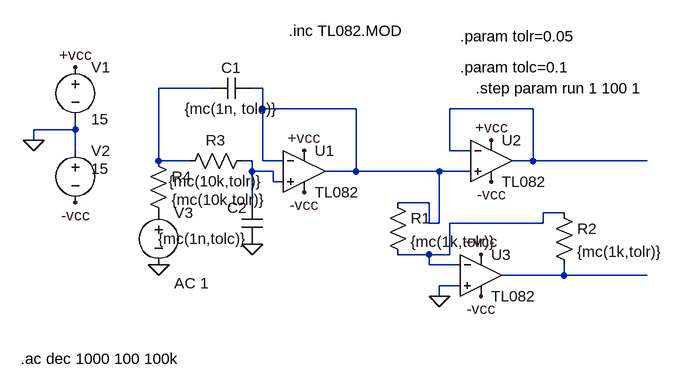
[diagram p0: schematic simSallenKey.asc]
simSallenKey.asc, the LTspice schematic file:
Version 4
SHEET 1 880 680
WIRE 0 0 -80 0
WIRE 80 0 64 0
WIRE 80 32 80 0
WIRE 224 32 80 32
WIRE 496 32 368 32
WIRE -208 64 -208 48
WIRE -208 64 -272 64
WIRE -272 80 -272 64
WIRE -208 96 -208 64
WIRE 368 96 368 32
WIRE 400 96 368 96
WIRE -80 112 -80 0
WIRE -32 112 -80 112
WIRE 64 112 48 112
WIRE 80 112 80 32
WIRE 112 112 80 112
WIRE 496 112 496 32
WIRE 496 112 464 112
WIRE 672 112 496 112
WIRE 64 128 64 112
WIRE 96 128 64 128
WIRE 224 128 224 32
WIRE 224 128 176 128
WIRE 352 128 224 128
WIRE 400 128 352 128
WIRE 96 144 96 128
WIRE 112 144 96 144
WIRE 64 176 64 128
WIRE 336 176 288 176
WIRE 544 192 512 192
WIRE 336 208 336 176
WIRE 352 208 352 128
WIRE 352 208 336 208
WIRE 512 208 512 192
WIRE 512 208 368 208
WIRE 336 256 288 256
WIRE 368 256 368 208
WIRE 368 256 336 256
WIRE 336 272 336 256
WIRE 384 272 336 272
WIRE 544 288 544 272
WIRE 544 288 448 288
WIRE 672 288 544 288
WIRE 384 304 352 304
WIRE 352 320 352 304
FLAG 352 320 0
FLAG -208 -32 +vcc
FLAG -208 176 -vcc
FLAG -272 80 0
FLAG 144 96 +vcc
FLAG 432 80 +vcc
FLAG 416 256 +vcc
FLAG 144 160 -vcc
FLAG 432 144 -vcc
FLAG 416 320 -vcc
FLAG 64 240 0
FLAG -80 272 0
SYMBOL Opamps\\opamp2 144 64 R0
SYMATTR InstName U1
SYMATTR Value TL082
SYMBOL Opamps\\opamp2 432 48 R0
SYMATTR InstName U2
SYMATTR Value TL082
SYMBOL Opamps\\opamp2 416 224 R0
SYMATTR InstName U3
SYMATTR Value TL082
SYMBOL voltage -208 -48 R0
SYMATTR InstName V1
SYMATTR Value 15
SYMBOL voltage -208 80 R0
WINDOW 3 24 44 Left 2
WINDOW 123 0 0 Left 2
WINDOW 39 0 0 Left 2
SYMATTR InstName V2
SYMATTR Value 15
SYMBOL res 272 160 R0
SYMATTR InstName R1
SYMATTR Value {mc(1k,tolr)}
SYMBOL res 528 176 R0
SYMATTR InstName R2
SYMATTR Value {mc(1k,tolr)}
SYMBOL cap 64 -16 R90
WINDOW 0 0 32 VBottom 2
WINDOW 3 32 32 VTop 2
SYMATTR InstName C1
SYMATTR Value {mc(1n, tolc)}
SYMBOL cap 80 240 R180
WINDOW 0 24 56 Left 2
WINDOW 3 24 8 Left 2
SYMATTR InstName C2
SYMATTR Value {mc(1n,tolc)}
SYMBOL res 64 96 R90
WINDOW 0 0 56 VBottom 2
WINDOW 3 32 56 VTop 2
SYMATTR InstName R3
SYMATTR Value {mc(10k,tolr)}
SYMBOL res -96 96 R0
SYMATTR InstName R4
SYMATTR Value {mc(10k,tolr)}
SYMBOL voltage -80 176 R0
WINDOW 123 24 124 Left 2
WINDOW 39 0 0 Left 2
SYMATTR InstName V3
SYMATTR Value ""
SYMATTR Value2 AC 1
TEXT -292 416 Left 2 !.ac dec 1000 100 100k
TEXT 384 -80 Left 2 !.param tolr=0.05
TEXT 384 -32 Left 2 !.param tolc=0.1
TEXT 120 -88 Left 2 !.inc TL082.MOD
TEXT 408 0 Left 2 !.step param run 1 100 1

The netlist it stands for:
* simSallenKey.asc
XU1 N004 N002 +vcc -vcc N002 TL082  ; pins In+ In- V+ V- OUT
XU2 N002 N003 +vcc -vcc N003 TL082  ; pins In+ In- V+ V- OUT
XU3 0 N005 +vcc -vcc N006 TL082  ; pins In+ In- V+ V- OUT
V1 +vcc 0 15
V2 0 -vcc 15
R1 N002 N005 {mc(1k,tolr)}
R2 N005 N006 {mc(1k,tolr)}
C1 N002 N001 {mc(1n, tolc)}
C2 0 N004 {mc(1n,tolc)}
R3 N004 N001 {mc(10k,tolr)}
R4 N001 P001 {mc(10k,tolr)}
V3 P001 0 AC 1
.ac dec 1000 100 100k
.param tolr=0.05
.param tolc=0.1
.inc TL082.MOD
.step param run 1 100 1
.backanno
.end